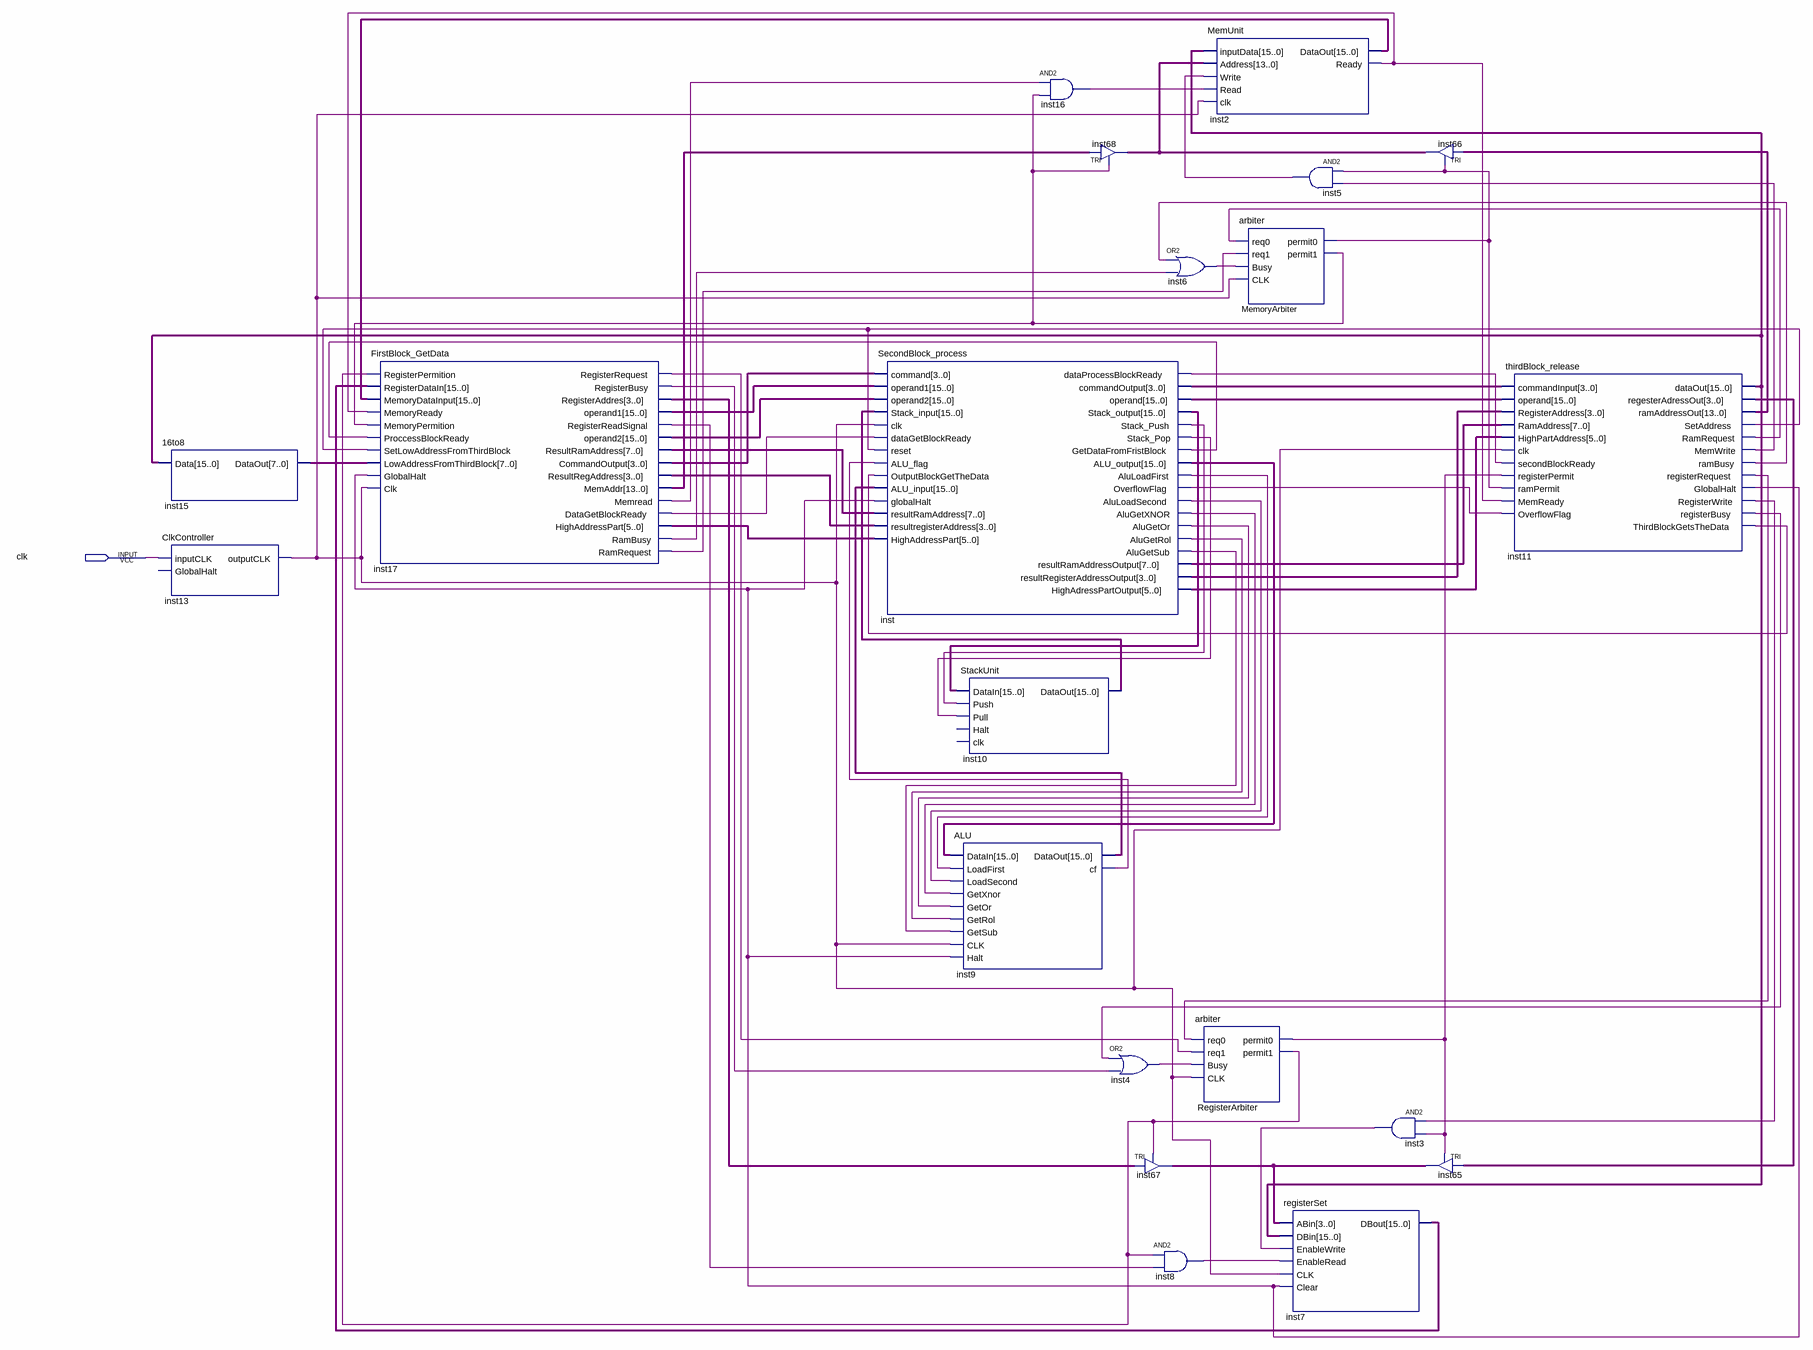
[diagram p0: schematic sheet]
// Quartus schematic MainBoard.bdf as structural Verilog: 21 symbols, 1 pins
module MainBoard (
  input  clk
);

  wire inst2_ready, inst3_out, inst4_out, inst5_out, inst6_out, inst8_out, inst9_cf, inst11_globalhalt,
       inst11_memwrite, inst11_rambusy, inst11_ramrequest, inst11_registerbusy, inst11_registerrequest,
       inst11_registerwrite, inst11_setaddress, inst11_thirdblockgetsthedata, inst13_outputclk, inst16_out,
       inst17_datagetblockready, inst17_memread, inst17_rambusy, inst17_ramrequest, inst17_registerbusy,
       inst17_registerreadsignal, inst17_registerrequest, inst_alugetor, inst_alugetrol, inst_alugetsub,
       inst_alugetxnor, inst_aluloadfirst, inst_aluloadsecond, inst_dataprocessblockready,
       inst_getdatafromfristblock, inst_overflowflag, inst_stack_pop, inst_stack_push, MemoryArbiter_permit0,
       MemoryArbiter_permit1, RegisterArbiter_permit0, RegisterArbiter_permit1;
  wire [3:0] inst11_regesteradressout, inst17_commandoutput, inst17_registeraddres, inst17_resultregaddress,
       inst67_out, inst_commandoutput, inst_resultregisteraddressoutput;
  wire [5:0] inst17_highaddresspart, inst_highadresspartoutput;
  wire [7:0] inst15_dataout, inst17_resultramaddress, inst_resultramaddressoutput;
  wire [13:0] inst11_ramaddressout, inst17_memaddr, inst68_out;
  wire [15:0] inst2_dataout, inst7_dbout, inst9_dataout, inst10_dataout, inst11_dataout, inst17_operand1,
       inst17_operand2, inst_alu_output, inst_operand, inst_stack_output;

  \16to8  inst15 (.Data(inst11_dataout), .DataOut(inst15_dataout));
  ClkController inst13 (.inputCLK(clk), .outputCLK(inst13_outputclk));  // open: GlobalHalt
  FirstBlock_GetData inst17 (
    .RegisterPermition(RegisterArbiter_permit1), .RegisterDataIn(inst7_dbout),
    .MemoryDataInput(inst2_dataout), .MemoryReady(inst2_ready), .MemoryPermition(MemoryArbiter_permit1),
    .ProccessBlockReady(inst_getdatafromfristblock), .SetLowAddressFromThirdBlock(inst11_setaddress),
    .LowAddressFromThirdBlock(inst15_dataout), .GlobalHalt(inst11_globalhalt), .Clk(inst13_outputclk),
    .RegisterRequest(inst17_registerrequest), .RegisterBusy(inst17_registerbusy),
    .RegisterAddres(inst17_registeraddres), .operand1(inst17_operand1),
    .RegisterReadSignal(inst17_registerreadsignal), .operand2(inst17_operand2),
    .ResultRamAddress(inst17_resultramaddress), .CommandOutput(inst17_commandoutput),
    .ResultRegAddress(inst17_resultregaddress), .MemAddr(inst17_memaddr), .Memread(inst17_memread),
    .DataGetBlockReady(inst17_datagetblockready), .HighAddressPart(inst17_highaddresspart),
    .RamBusy(inst17_rambusy), .RamRequest(inst17_ramrequest));
  SecondBlock_process inst (
    .command(inst17_commandoutput), .operand1(inst17_operand1), .operand2(inst17_operand2),
    .Stack_input(inst10_dataout), .clk(inst13_outputclk), .dataGetBlockReady(inst17_datagetblockready),
    .reset(inst11_setaddress), .ALU_flag(inst9_cf), .OutputBlockGetTheData(inst11_thirdblockgetsthedata),
    .ALU_input(inst9_dataout), .globalHalt(inst11_globalhalt), .resultRamAddress(inst17_resultramaddress),
    .resultregisterAddress(inst17_resultregaddress), .HighAddressPart(inst17_highaddresspart),
    .dataProcessBlockReady(inst_dataprocessblockready), .commandOutput(inst_commandoutput),
    .operand(inst_operand), .Stack_output(inst_stack_output), .Stack_Push(inst_stack_push),
    .Stack_Pop(inst_stack_pop), .GetDataFromFristBlock(inst_getdatafromfristblock),
    .ALU_output(inst_alu_output), .AluLoadFirst(inst_aluloadfirst), .OverflowFlag(inst_overflowflag),
    .AluLoadSecond(inst_aluloadsecond), .AluGetXNOR(inst_alugetxnor), .AluGetOr(inst_alugetor),
    .AluGetRol(inst_alugetrol), .AluGetSub(inst_alugetsub),
    .resultRamAddressOutput(inst_resultramaddressoutput),
    .resultRegisterAddressOutput(inst_resultregisteraddressoutput),
    .HighAdressPartOutput(inst_highadresspartoutput));
  StackUnit inst10 (
    .DataIn(inst_stack_output), .Push(inst_stack_push), .Pull(inst_stack_pop), .DataOut(inst10_dataout));  // open: Halt, clk
  ALU inst9 (
    .DataIn(inst_alu_output), .LoadFirst(inst_aluloadfirst), .LoadSecond(inst_aluloadsecond),
    .GetXnor(inst_alugetxnor), .GetOr(inst_alugetor), .GetRol(inst_alugetrol), .GetSub(inst_alugetsub),
    .CLK(inst13_outputclk), .Halt(inst11_globalhalt), .DataOut(inst9_dataout), .cf(inst9_cf));
  and inst16 (inst16_out, inst17_memread, MemoryArbiter_permit1);
  TRI inst68[13:0] (.IN(inst17_memaddr), .OE(MemoryArbiter_permit1), .OUT(inst68_out));
  or inst4 (inst4_out, inst11_registerbusy, inst17_registerbusy);
  or inst6 (inst6_out, inst11_rambusy, inst17_rambusy);
  TRI inst67[3:0] (.IN(inst17_registeraddres), .OE(RegisterArbiter_permit1), .OUT(inst67_out));
  and inst8 (inst8_out, RegisterArbiter_permit1, inst17_registerreadsignal);
  MemUnit inst2 (
    .inputData(inst11_dataout), .Address(inst68_out), .Write(inst5_out), .Read(inst16_out),
    .clk(inst13_outputclk), .DataOut(inst2_dataout), .Ready(inst2_ready));
  arbiter RegisterArbiter (
    .req0(inst11_registerrequest), .req1(inst17_registerrequest), .Busy(inst4_out), .CLK(inst13_outputclk),
    .permit0(RegisterArbiter_permit0), .permit1(RegisterArbiter_permit1));
  arbiter MemoryArbiter (
    .req0(inst11_ramrequest), .req1(inst17_ramrequest), .Busy(inst6_out), .CLK(inst13_outputclk),
    .permit0(MemoryArbiter_permit0), .permit1(MemoryArbiter_permit1));
  and inst5 (inst5_out, MemoryArbiter_permit0, inst11_memwrite);
  registerSet inst7 (
    .ABin(inst67_out), .DBin(inst11_dataout), .EnableWrite(inst3_out), .EnableRead(inst8_out),
    .CLK(inst13_outputclk), .Clear(inst11_globalhalt), .DBout(inst7_dbout));
  and inst3 (inst3_out, inst11_registerwrite, RegisterArbiter_permit0);
  TRI inst66[13:0] (.IN(inst11_ramaddressout), .OE(MemoryArbiter_permit0), .OUT(inst68_out));
  TRI inst65[3:0] (.IN(inst11_regesteradressout), .OE(RegisterArbiter_permit0), .OUT(inst67_out));
  thirdBlock_release inst11 (
    .commandInput(inst_commandoutput), .operand(inst_operand),
    .RegisterAddress(inst_resultregisteraddressoutput), .RamAddress(inst_resultramaddressoutput),
    .HighPartAddress(inst_highadresspartoutput), .clk(inst13_outputclk),
    .secondBlockReady(inst_dataprocessblockready), .registerPermit(RegisterArbiter_permit0),
    .ramPermit(MemoryArbiter_permit0), .MemReady(inst2_ready), .OverflowFlag(inst_overflowflag),
    .dataOut(inst11_dataout), .regesterAdressOut(inst11_regesteradressout),
    .ramAddressOut(inst11_ramaddressout), .SetAddress(inst11_setaddress), .RamRequest(inst11_ramrequest),
    .MemWrite(inst11_memwrite), .ramBusy(inst11_rambusy), .registerRequest(inst11_registerrequest),
    .GlobalHalt(inst11_globalhalt), .RegisterWrite(inst11_registerwrite), .registerBusy(inst11_registerbusy),
    .ThirdBlockGetsTheData(inst11_thirdblockgetsthedata));
endmodule
